# EAGLE design Light (EAGLE 7.2.0)
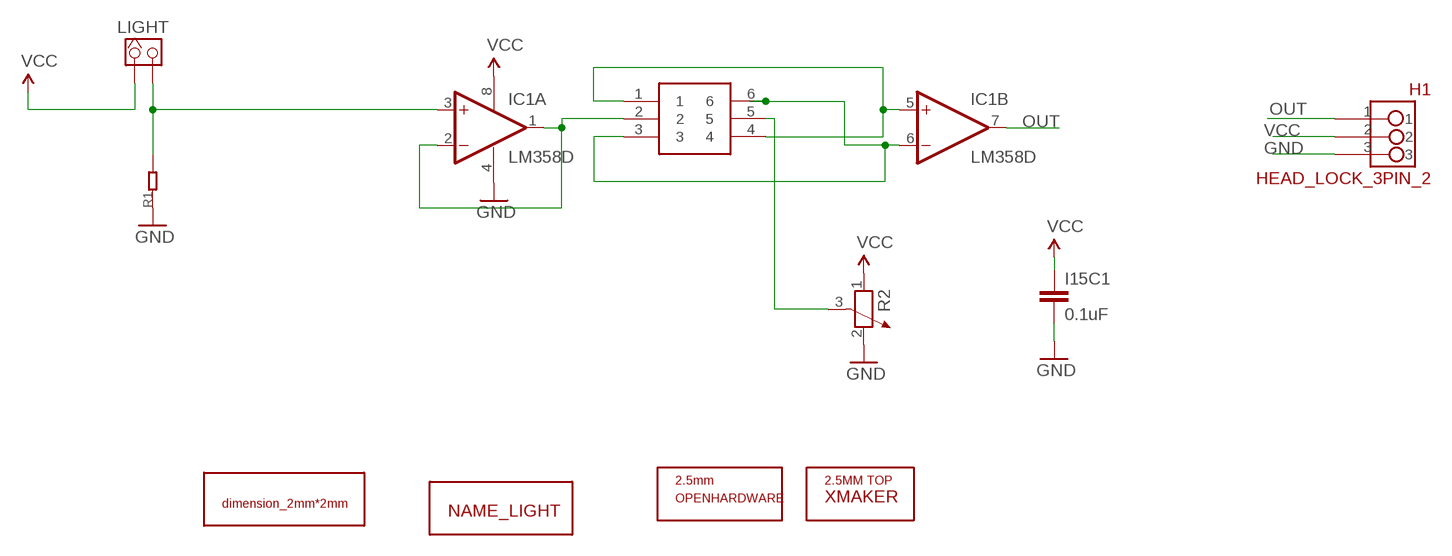
[diagram p0: schematic, sheet 1]

## Parts
H1  HEAD_LOCK_3PIN_2  [HEAD_LOCK_3PIN_2]
I15C1  0.1uF  CAP0603-CAP  [0603-CAP]
IC1  LM358D  [SO08]
LIGHT  HEADER_1X2_2.54  [CK_1*2]
R1  R0603  [0603]
R2  R-POTENTIOMETER3362  [3P-SQUA-7X6.8]
U$1  DIMENSION_2MM2MM  [DIMENSION_2MM*2MM]
U$2  NAME_LIGHT  [NAME_LIGHT]
U$3  OPENHARDWARE_2.5MM_TOP  [OPENSOURCELOGO_2.5MM]
U$4  XMAKERLOGO_2.5MM_TOP  [XMAKERLOGO_2.5MM_TOP]
U$5  MSS-22C02  [MSS-22C02]

## Nets
GND: H1.3 I15C1.2 IC1.4(P:V-) R1.1 R2.2
N$1: IC1.1(A:OUT) IC1.2(A:-IN) U$5.2
N$2: IC1.3(A:+IN) LIGHT.2 R1.2
N$3: IC1.5(B:+IN) U$5.1 U$5.4
N$4: R2.3 U$5.5
N$5: IC1.6(B:-IN) U$5.3 U$5.6
OUT: H1.1 IC1.7(B:OUT)
VCC: H1.2 I15C1.1 IC1.8(P:V+) LIGHT.1 R2.1

## Library data of the parts
H1 = Xmaker:HEAD_LOCK_3PIN_2
I15C1 = SparkFun:CAP: Capacitor Standard 0603 ceramic capacitor, and 0.1" leaded capacitor.
IC1 = linear:LM358: OP AMP also LM158; LM258; LM2904 Source: http://cache.national.com/ds/LM/LM158.pdf
LIGHT = CONNECTER:HEADER_1X2
R1 = CPT_SMD:R0603
R2 = Discrete:R-POTENTIOMETER*: Potentiometer
U$1 = Xmaker:DIMENSION_2MM*2MM
U$2 = Xmaker:NAME_LIGHT
U$3 = Xmaker:OPENHARDWARE_2.5MM_TOP
U$4 = Xmaker:XMAKERLOGO_2.5MM_TOP
U$5 = Xmaker:MSS-22C02

## Board
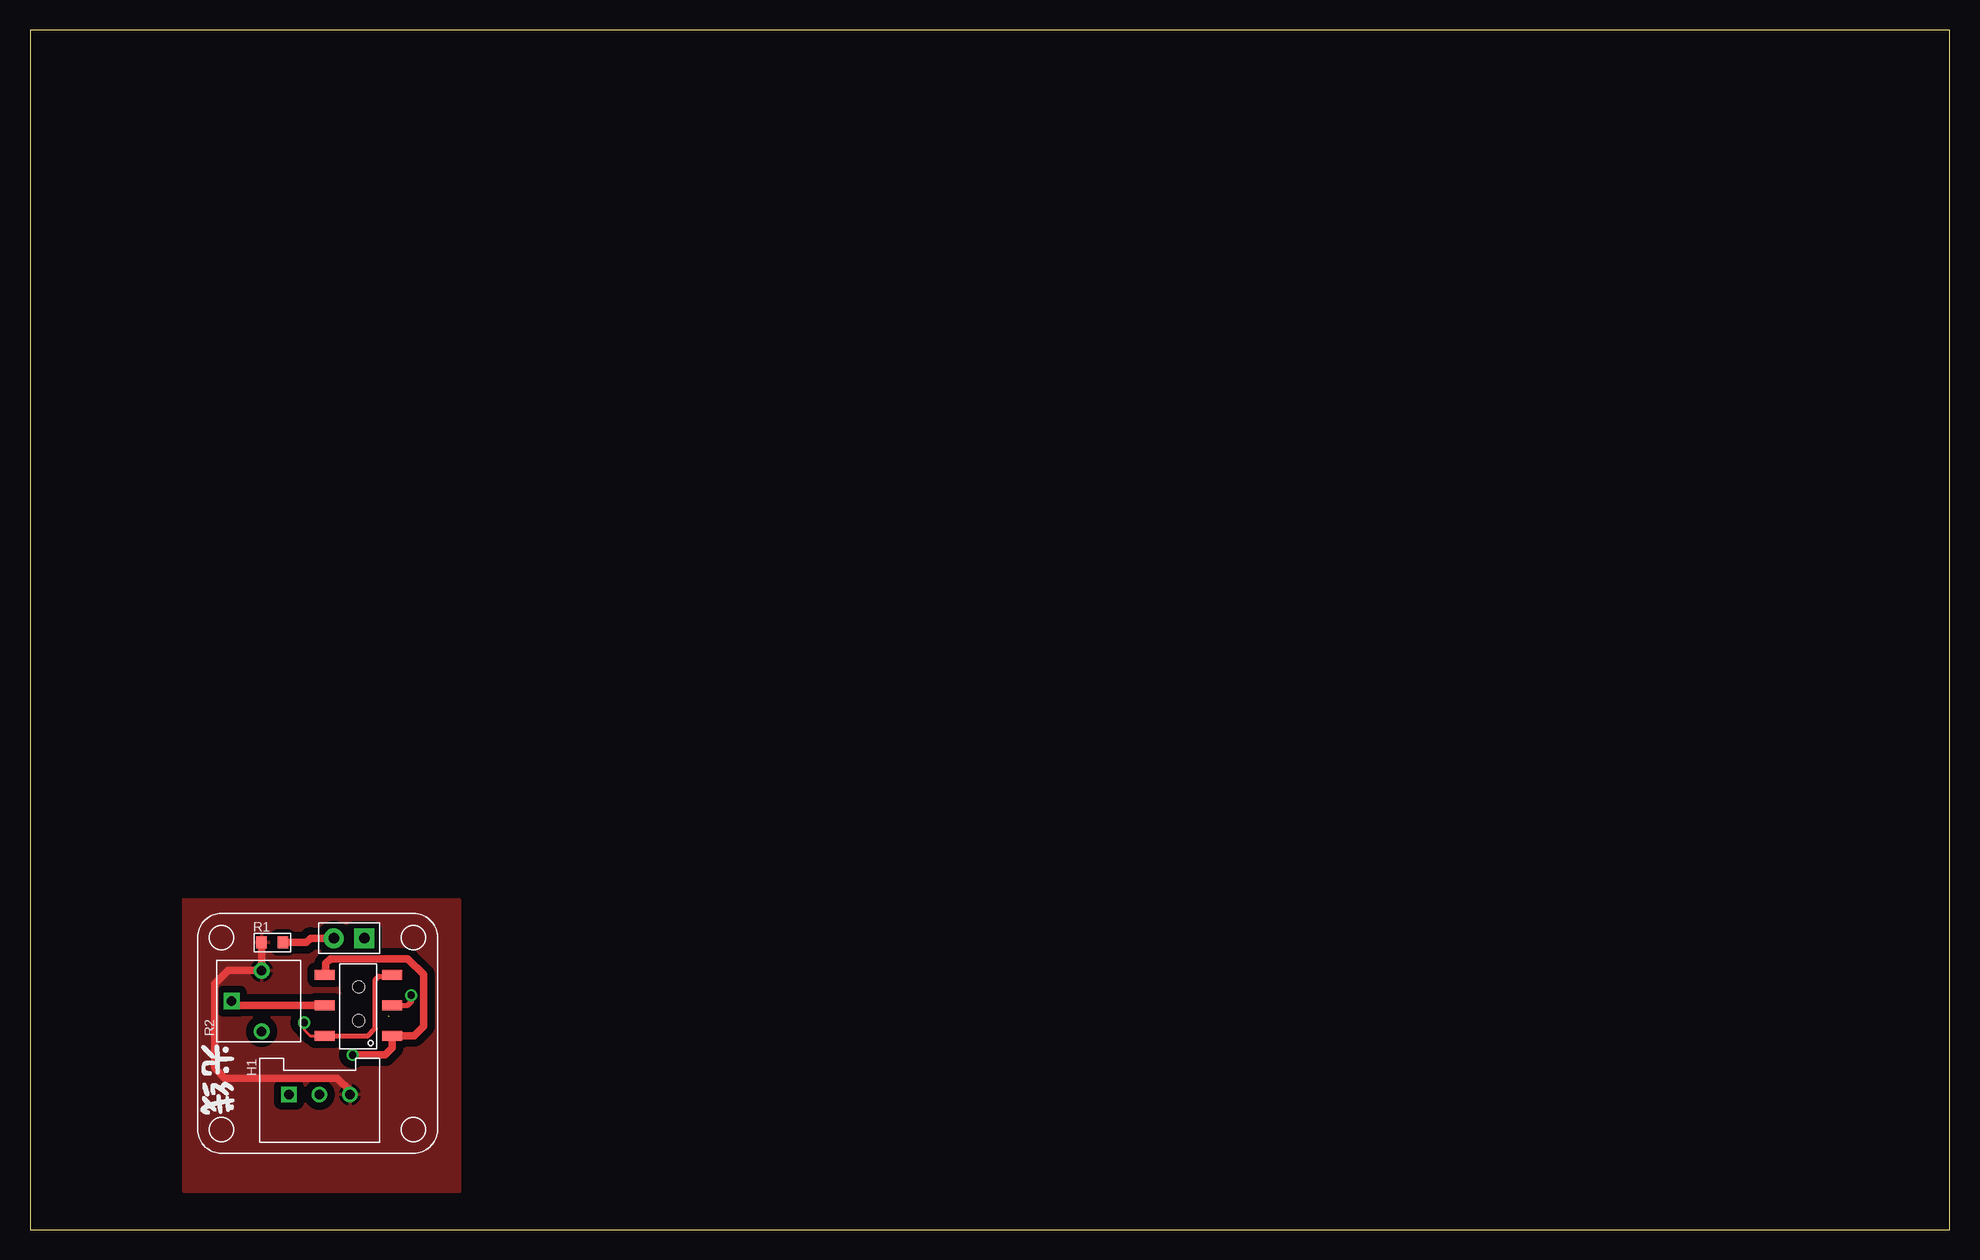
[diagram p1: board, top side]
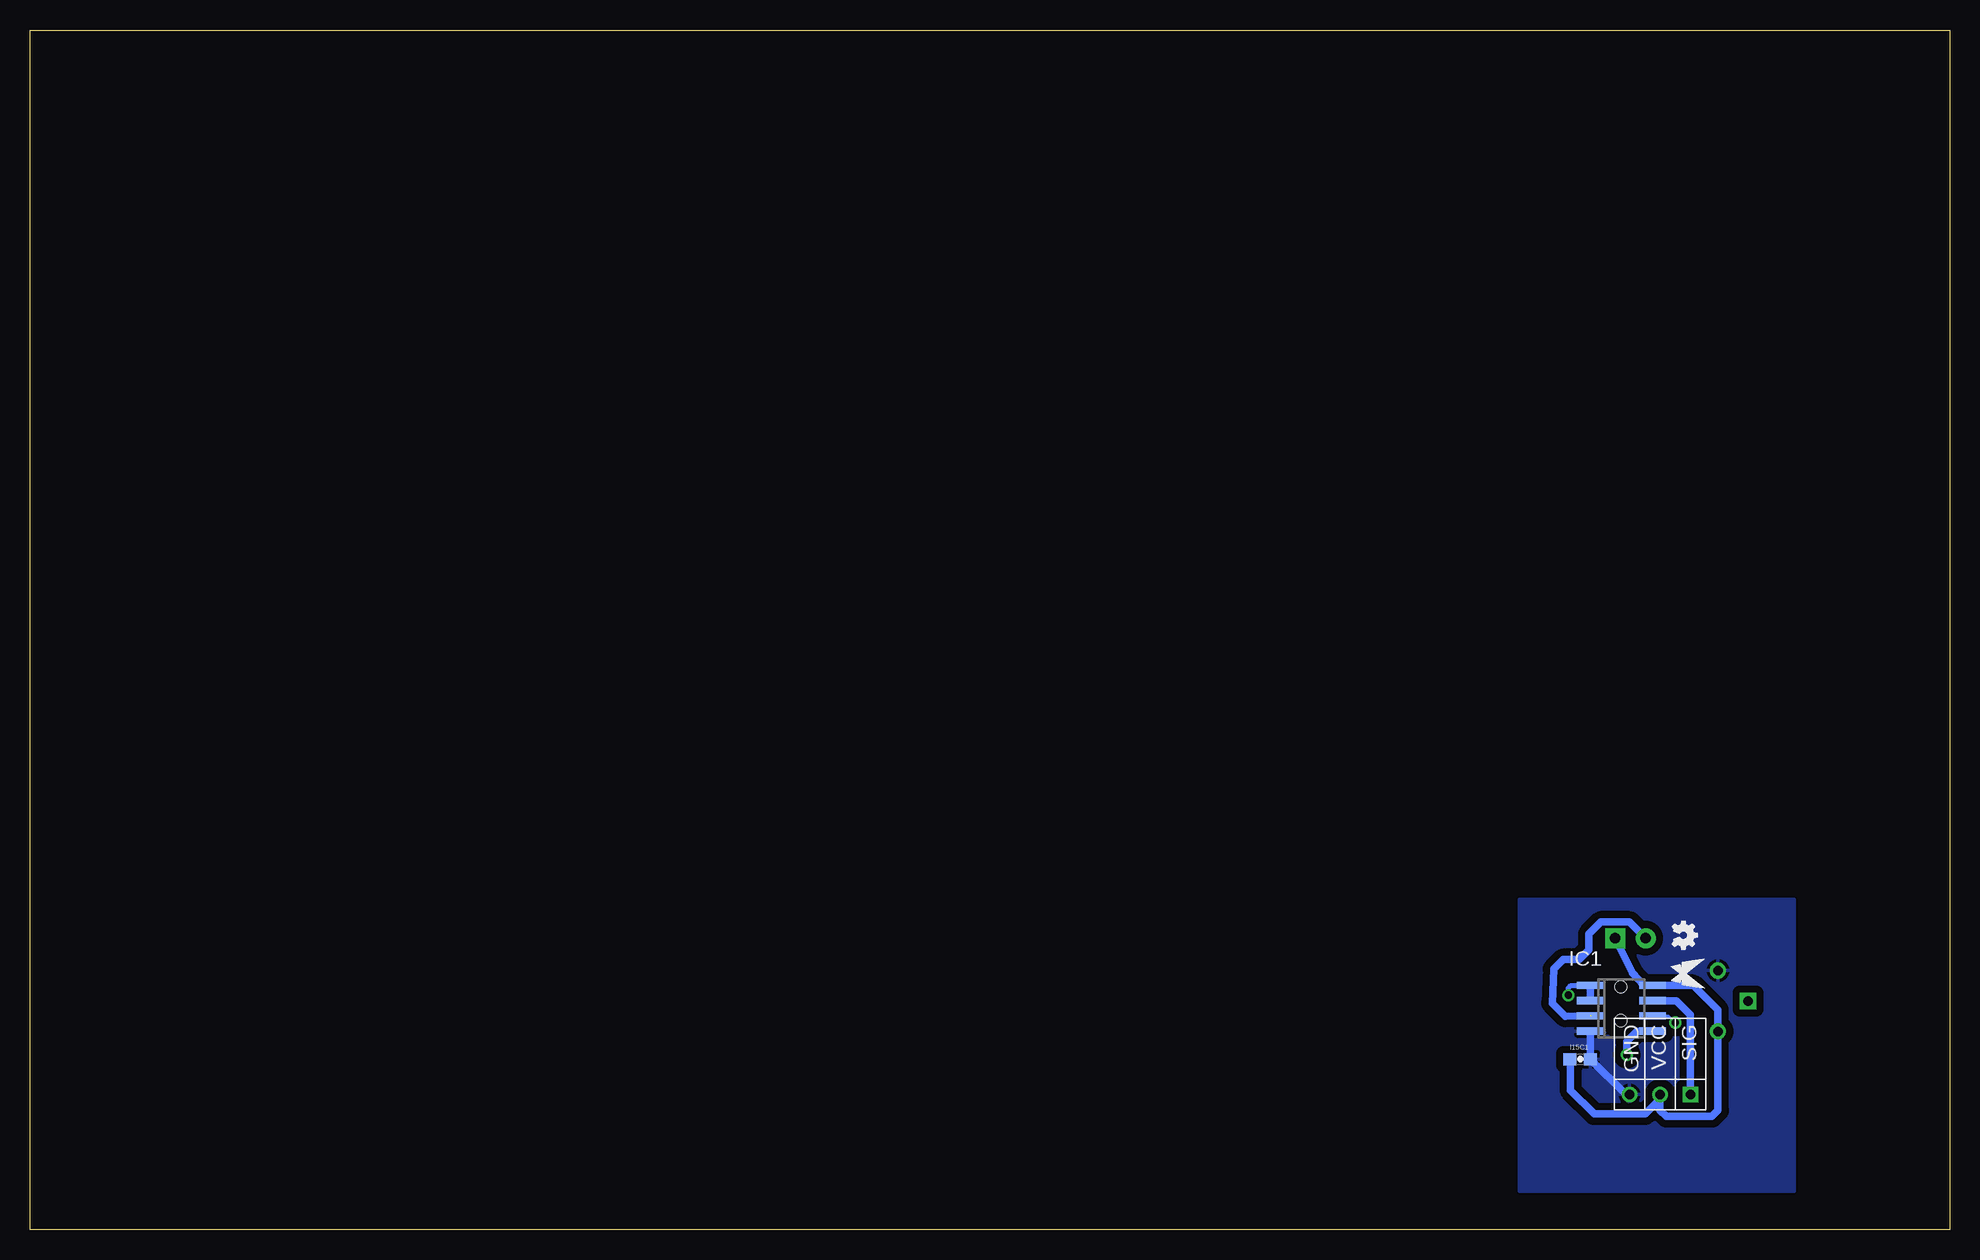
[diagram p2: board, bottom side, seen from below]

Size 160 x 100 mm. Coordinates in mm from the lower left corner, seen from the top.
Outline: 0,0 160,0 160,100 0,100 0,0
Copper layers (1*16): Top 0.035mm / dielectric 1.5mm / Bottom 0.035mm
Design rules "default": minimum track width 10mil, minimum drill 24mil, track to track 8mil, track to pad 8mil, pad to pad 8mil, via to via 8mil, smd to smd 8mil, copper to edge 40mil, drill to drill 8mil, minimum pad ring 10mil, minimum via ring 8mil, stop-mask expansion 4mil, vias tented up to drill 0mil, thermal gap 10mil

### Footprints (pad centres in the part's own frame; a part is rotated, then mirrored left to right if it is on the bottom)
HEAD_LOCK_3PIN_2 = drill 0.8 square: 1 0,2.54 | drill 0.8: 2 0,0; 3 0,-2.54
0603-CAP = smd 1.1 x 1: 1 -0.85,0; 2 0.85,0
SO08 = smd 0.6 x 2.2: 1 -1.905,-2.6; 2 -0.635,-2.6; 3 0.635,-2.6; 4 1.905,-2.6; 5 1.905,2.6; 6 0.635,2.6; 7 -0.635,2.6; 8 -1.905,2.6
CK_1*2 = drill 0.889 pad 1.651 square: 1 0,1.27 | drill 0.889 pad 1.651: 2 0,-1.27
0603 = smd 0.889 x 1.016: 1 -0.889,0; 2 0.889,0
3P-SQUA-7X6.8 = drill 0.8 pad 1.35: 1 -2.54,-0.25; 2 2.54,-0.25 | drill 0.8 pad 1.35 square: 3 0,2.25
MSS-22C02 = smd 1.676 x 0.813: 1 0,0; 2 0,-2.54; 3 0,-5.08; 4 5.65,-5.08; 5 5.65,-2.54; 6 5.65,0 | hole 1: 2.794,-1.27; 2.794,-4.064

### Placement (x,y rotation side)
H1  24.13,11.25 90 top
I15C1  30.78,14.2 0 bottom
IC1  27.36,18.44 270 bottom
LIGHT  26.59,24.28 270 top
R1  20.19,23.93 0 top
R2  19.05,19.05 90 top
U$1  13.97,6.35 0 top
U$2  13.84,12.47 270 top
U$3  22.17,24.56 270 bottom
U$4  21.82,21.36 270 bottom
U$5  30.2,16.15 180 top

### Tracks (layer width: path | path; a pad name or v marks a point on that pad's centre or on a via)
GND
  Top 0.61: R1.1 R2.2 16.51,21.59 15.39,20.47 15.39,13.46 16.23,12.62 25.6,12.62 26.67,11.56 H1.3
  Bottom 0.61: IC1.4 29.93,16.51 I15C1.2 26.99,11.25 H1.3
  pour Top (isolate 0.61): 12.88,27.48 35.81,27.48 35.81,3.2 12.83,3.2 12.83,27.51
  pour Bottom (isolate 0.61): 12.93,27.53 35.84,27.53 35.84,3.17 12.93,3.17
N$1  (via drill 0.61)
  Top 0.406: U$5.2 30.23,18.67 31.47,18.67 31.77,18.97 v31.77,19.53
  Bottom 0.254: 30.63,20.34 IC1.1
  Bottom 0.406: v31.77,19.53 31.77,20.12 31.55,20.34 30.63,20.34
  Bottom 0.61: IC1.2 IC1.1
N$2  (1 unrouted)
  Top 0.61: R1.2 23.04,23.93 23.39,24.28 LIGHT.2
  Bottom 0.61: LIGHT.2 26.67,25.63 29.06,25.63 30.05,24.64 30.05,23.29 30.84,22.5 32.21,22.5 32.99,21.72 33.12,18.87 32.03,17.78 29.87,17.8
N$3  (via drill 0.61)
  Top 0.61: U$5.4 24.64,21.32 24.64,22.17 25.04,22.58 31.5,22.58 32.82,21.26 32.82,16.94 32.03,16.15 U$5.1 30.2,15.14 29.62,14.55 v26.9,14.55
  Bottom 0.61: IC1.5 26.06,16.54 26.9,15.7 v26.9,14.55
N$4
  Top 0.61: U$5.5 17.16,18.69 R2.3
N$5  (via drill 0.61)
  Top 0.254: v22.86,17.25 22.86,16.66 23.37,16.15 U$5.6
  Top 0.406: U$5.6 28.17,16.15 28.78,16.76 28.78,20.83 29.06,21.11 30.07,21.11 U$5.3
  Bottom 0.254: IC1.6 23.42,17.8 v22.86,17.25
OUT
  Bottom 0.61: IC1.7 22.76,19.07 21.59,17.91 H1.1
VCC
  Bottom 0.61: I15C1.1 31.6,14.16 31.6,11.61 29.62,9.63 25.38,9.63 24.13,10.87 H1.2 24.13,9.96 23.6,9.42 19.81,9.42 19.3,9.94 R2.1 19.33,16.54 19.33,18.31 21.36,20.34 IC1.8 25.48,20.34 26.44,21.41 LIGHT.1